# Altium schematic sheet Mother Board Driver Interface.SchDoc
size A4
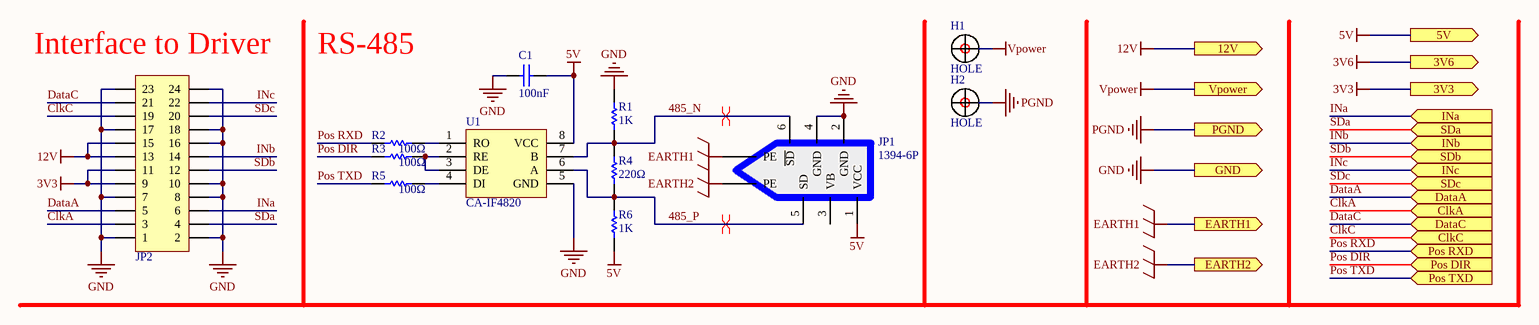
[diagram p0: Mother Board Driver Interface.SchDoc]

## Parts
C1  100nF  [C0603]
H1  HOLE  [定位孔 Φ3 1]
H2  HOLE  [定位孔 Φ3 1]
JP1  1394-6P  [1394-6P]
JP2  Header 2X12  [HEADER_0.8mm_2x12P_M]  (value not drawn)
R1  1K  [R0603]
R2  100Ω  [R0603]
R3  100Ω  [R0603]
R4  220Ω  [R0603]
R5  100Ω  [R0603]
R6  1K  [R0603]
U1  CA-IF4820  [SOP8_N]

## Ports
3V3 (out), 3V6 (out), 5V (out), 12V (out), ClkA (in), ClkC (in), DataA (in), DataC (in), EARTH1 (out), EARTH2 (out), GND (out), INa (in), INb (in), INc (in), PGND (out), Pos DIR (in), Pos RXD (in), Pos TXD (in), SDa (in), SDb (in), SDc (in), Vpower (out)

## Nets
3V3: JP2.9 JP2.11 ; port 3V3
3V6: port 3V6
5V: C1.2 JP1.1(VCC) R6.1 U1.8(VCC) ; port 5V
12V: JP2.13 JP2.15 ; port 12V
EARTH1: JP1.7(PE) ; port EARTH1
EARTH2: JP1.8(PE) ; port EARTH2
GND: C1.1 JP1.2(GND) JP1.4(GND) JP2.1 JP2.2 JP2.7 JP2.8 JP2.10 JP2.16 JP2.17 JP2.18 JP2.23 JP2.24 R1.2 U1.5(GND) ; port GND
PGND: H2.1 ; port PGND
Vpower: H1.1 ; port Vpower
485_N: JP1.6(~{SD}) R1.1 R4.2 U1.7(B)
485_P: JP1.5(SD) R4.1 R6.2 U1.6(A)
ClkA: JP2.3 ; port ClkA
ClkC: JP2.19 ; port ClkC
DataA: JP2.5 ; port DataA
DataC: JP2.21 ; port DataC
INa: JP2.6 ; port INa
INb: JP2.14 ; port INb
INc: JP2.22 ; port INc
Pos DIR: R3.1 ; port Pos DIR
Pos RXD: R2.1 ; port Pos RXD
Pos TXD: R5.1 ; port Pos TXD
SDa: JP2.4 ; port SDa
SDb: JP2.12 ; port SDb
SDc: JP2.20 ; port SDc
NetR2_2: R2.2 U1.1(RO)
NetR3_2: R3.2 U1.2(RE) U1.3(DE)
NetR5_2: R5.2 U1.4(DI)

Not connected (* = marked no-connect by the designer): JP1 3(VB)

## Layout directives
differential pair: 485_N, 485_P

## Notes on the sheet
- (near JP2) Interface to Driver
- RS-485

## Library data of the parts
C1 = Cap
JP1 = 1394-6P: IEEE 1394 FireWire接口
JP2 = Header 12PX2: 12*2P接插件; 版权归属: 源创客; BOM名称: 12*2P接插件; 学习资源: www.ooocke.com
R1-R6 = RES
U1 = CA-IF4820: 485总线芯片